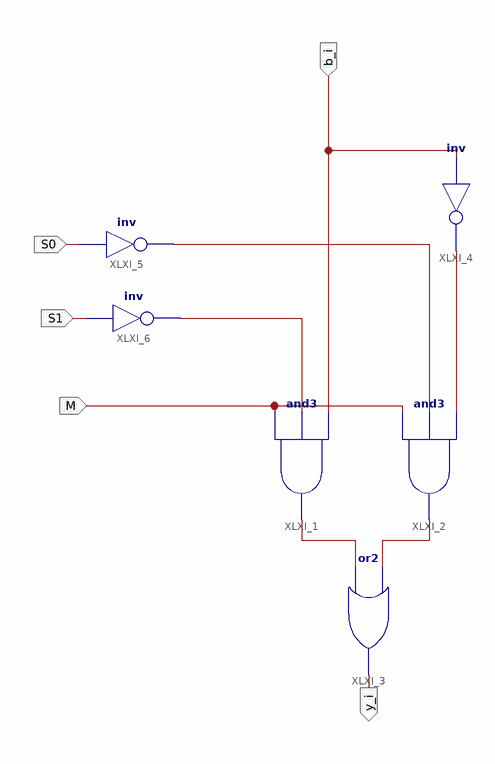
[diagram p0: schematic sheet 1]
// Xilinx ISE schematic Arithmetic_extender.sch (spartan3e) as structural Verilog: 6 symbols, 5 ports
module Arithmetic_extender (
  input  b_i,
  input  M,
  input  S0,
  input  S1,
  output y_i
);

  wire XLXN_1, XLXN_2, XLXN_5, XLXN_6, XLXN_7;

  and XLXI_1 (XLXN_1, M, XLXN_7, b_i);
  and XLXI_2 (XLXN_2, M, XLXN_6, XLXN_5);
  or XLXI_3 (y_i, XLXN_1, XLXN_2);
  not XLXI_4 (XLXN_5, b_i);
  not XLXI_5 (XLXN_6, S0);
  not XLXI_6 (XLXN_7, S1);
endmodule
